# Altium schematic sheet chargerShield.SchDoc
size A4
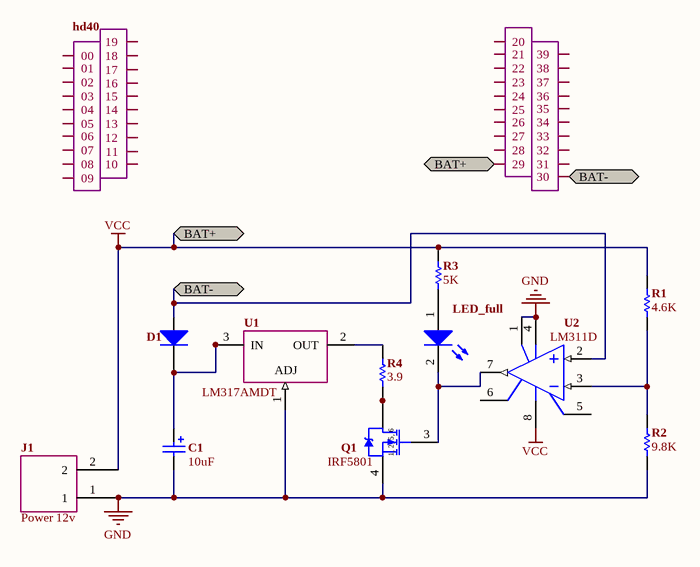
[diagram p0: chargerShield.SchDoc]

## Parts
C1  value 10uF  [Radial_pol_2.7]  (hidden comment: Cap Pol)
D1  Diode 1N4007  [DIO10.46-5.3x2.8]  (value not drawn)
hd40  header_cognitiveNGD_shield  [header_cognitiveNGD_longlegs]  (value not drawn)
J1  Power 12v  [Conector ED-1631]
LED_full  LED_SMD_Hg  [0603[1608] pol]  (value not drawn)
Q1  IRF5801  [SOT23-6]
R1  value 4.6K  [1608[0603]]  (hidden comment: resistor)
R2  value 9.8K  [1608[0603]]  (hidden comment: resistor)
R3  value 5K  [1608[0603]]  (hidden comment: resistor)
R4  value 3.9  [AXIAL-0.4]  (hidden comment: resistor)
U1  LM317AMDT  [TO-220AB]
U2  LM311D  [SOIC-8]

## Ports
BAT+, BAT-

## Nets
GND: C1.2 J1.1 Q1.4(S) R2.1 U1.1(ADJ) U2.1(GND) U2.4(V-)
VCC: hd40.29 J1.2 R1.2 R3.2 U2.8(V+) ; port BAT+
BAT-: D1.1(A) hd40.30 U2.2(IN+) ; port BAT-
NetC1_1: C1.1 D1.2(K) U1.3(IN)
NetLED_full_1: LED_full.1(A) R3.1
NetLED_full_2: LED_full.2(K) Q1.3(G) U2.7(OUT)
NetQ1_1: Q1.1(D) Q1.2(D) Q1.5(D) Q1.6(D) R4.1
NetR1_1: R1.1 R2.2 U2.3(IN-)
NetR4_2: R4.2 U1.2(OUT)

Not connected (* = marked no-connect by the designer): hd40 00 01 02 03 04 05 06 07 08 09 10 11 12 13 14 15 16 17 18 19 20 21 22 23 24 25 26 27 28 31 32 33 34 35 36 37 38 39; U2 5(BAL) 6(BAL/STB)

## Notes on the sheet
- (in symbol IRF5801) 1, 2, 5, 6

## Library data of the parts
C1 = Cap Pol: Polarized Capacitor (Surface Mount); Manufacturer: Generic Components; Class: Passive; Published: 08/06/2000; Publisher: Altium Hobart Technology Centre; SubClass: Capacitor
D1 = Diode 1N4007: 1 Amp General Purpose Rectifier; Published: 8-Jun-2000; LatestRevisionDate: 17-Jul-2002; LatestRevisionNote: Re-released for DXP Platform.; DatasheetVersion: 1998; PackageVersion: Aug-1999; PackageReference: DO-41; Publisher: Altium Limited; Code_JEDEC: DO-204-AL; ComponentLink1Description: Manufacturer Link; ComponentLink1URL: http://www.fairchildsemi.com/; ComponentLink2Description: Datasheet; ComponentLink2URL: http://www.fairchildsemi.com/ds/1N%2F1N4001.pdf
hd40 = header_cognitiveNGD
J1 = Conector ED-1631: Terminal Block 2 vías, 5mm
LED_full = LED_SMD_Hg: Typical BLUE SiC LED; Manufacturer: Generic Components; Class: Optoelectronic; Published: 08/06/2000; Publisher: Altium Hobart Technology Centre; SubClass: LED
Q1 = IRF5801: HEXFET Power MOSFET; Published: 17-Sep-2003; DatasheetVersion: 9-Jul-2002; PackageVersion: Jul-2002; PackageReference: TSOP-6; Publisher: Altium Limited; PackageDescription: SOT-457/SC-74; 6 Leads; Body 3.1 x 2.9 mm, inc. leads (LxW max); Code_JEDEC: MO-193AA; ComponentLink1Description: Manufacturer Link; ComponentLink1URL: http://www.irf.com/; ComponentLink2Description: Datasheet; ComponentLink2URL: http://www.irf.com/product-info/datasheets/data/IRHN7130.pdf
R1-R4 = RES: Published: 8-Jun-2000; LatestRevisionDate: 17-Jul-2002; LatestRevisionNote: Re-released for DXP Platform.; PackageReference: AXIAL-0.3; Publisher: Altium Limited; PackageDescription: Axial Device, Thru-Hole; 2 Leads; 0.3 in Pin Spacing
U1 = LM317AMDT: 3-Terminal Adjustable Regulator; Manufacturer: National Semiconductor; CompType: LDO IC; PackageTopMarking: NSUZXYTT*LM317*AMDT; PowerWise: N; Published: 4-Dec-2008; DatasheetVersion: Apr-2007; PackageVersion: revC, Apr-2003; PackageReference: TD03B; Publisher: Altium Limited; PackageDescription: TO252, Molded, Jedec, 6.8 x 6.10 x 2.30mm Body, 3 Lead, 2.28mm Pitch, Surface Mount; PartNumber: LM317AMDT; RoHS: O; PinCount: 3; DigiKeyPartNumber: LM317AMDT-ND; Code_JEDEC: TO-252-AA; ComponentLink1Description: LM317 Datasheet; ComponentLink1URL: http://www.national.com/ds/LM/LM317.pdf; ComponentLink2Description: LM317 Web Page; ComponentLink2URL: http://www.national.com/pf/LM/LM317.html; ComponentLink3Description: TD03B Package Page; ComponentLink3URL: http://www.national.com/packaging/folders/td03b.html
U2 = LM311D: High-Performance Voltage Comparator; Published: 17-Jul-2002; LatestRevisionDate: 13-Apr-2006; LatestRevisionNote: IPC-7351 Footprint Added.; DatasheetVersion: 1988; PackageReference: 751-02; Publisher: Altium Limited; PackageDescription: 8-Pin Small Outline Integrated Circuit 1.27 mm Pitch; Code_JEDEC: MS-012-AA; Code_IPC: SOIC127P600-8; ComponentLink1Description: Manufacturer Link; ComponentLink1URL: http://www.onsemi.com/site/products/taxonomy/0,4438,133,00.html